# EAGLE design ble_keyboard (EAGLE 9.1.2)

## Sheet 1 of 2: Cover page

## Sheet 2 of 2
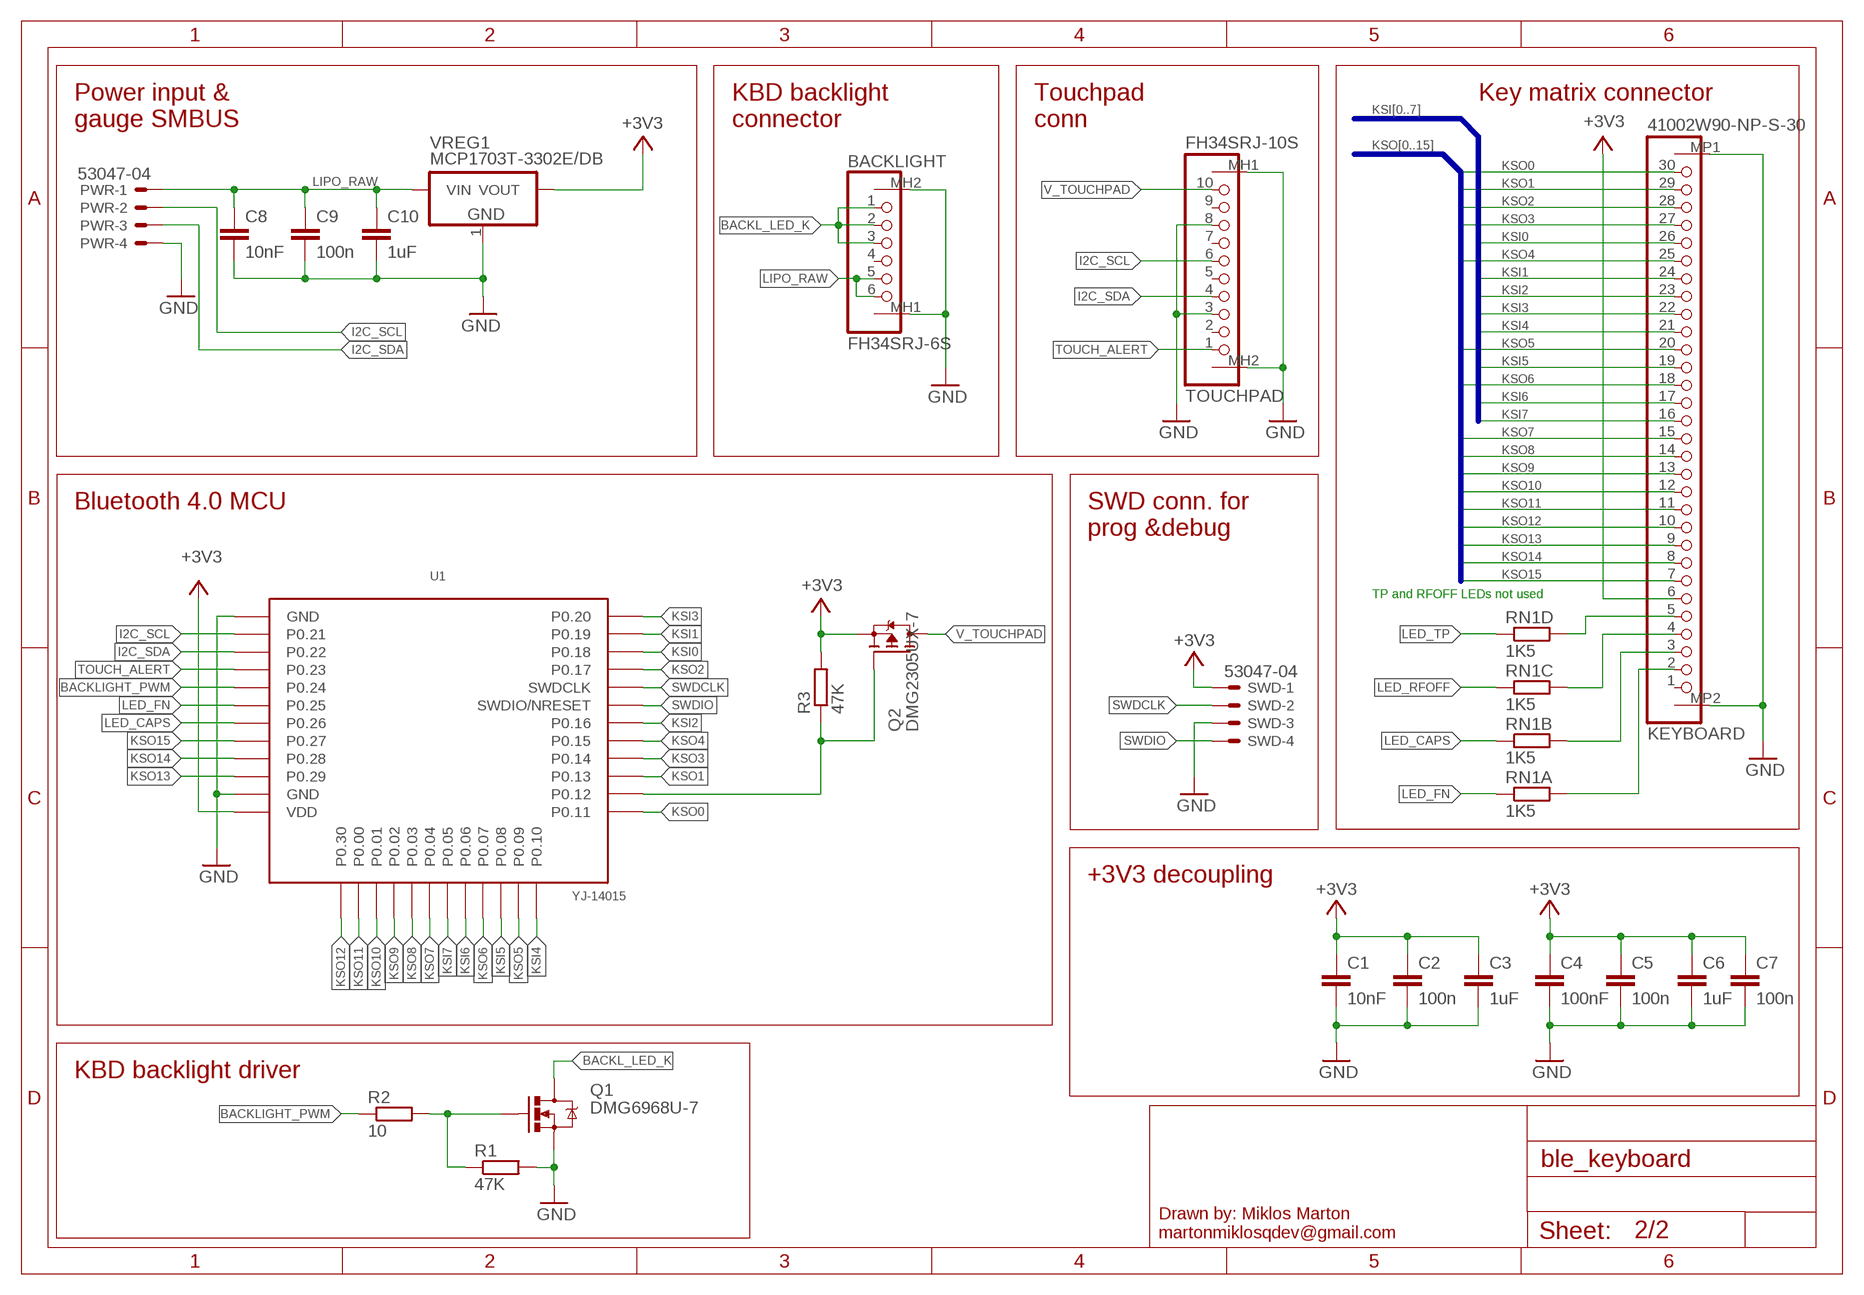
[diagram p0: schematic, sheet 2]

### Parts
BACKLIGHT  FH34SRJ-6S  [FH34SRJ-6S]
C1  10nF  C-EUC0603  [C0603]
C2  100n  C-EUC0603  [C0603]
C3  1uF  C-EUC0603  [C0603]
C4  100nF  C-EUC0603  [C0603]
C5  100n  C-EUC0603  [C0603]
C6  1uF  C-EUC0603  [C0603]
C7  100n  C-EUC0603  [C0603]
C8  10nF  C-EUC0603  [C0603]
C9  100n  C-EUC0603  [C0603]
C10  1uF  C-EUC0603  [C0603]
KEYBOARD  41002W90-NP-S-30  [41200W90-NP-S]
PWR  53047-04  [53047-04]
Q1  DMG6968U-7  MOSFET-NCHANNELSMD  [SOT23-3]
Q2  DMG2305UX-7  BSA223SPSOT23  [SOT23]
R1  47K  R-EU_R0603  [R0603]
R2  10  R-EU_R0603  [R0603]
R3  47K  R-EU_R0603  [R0603]
RN1  1K5  RESISTOR_ARRAY_4  [RN8P-4R-CRA06S]
SWD  53047-04  [53047-04]
TOUCHPAD  FH34SRJ-10S  [FH34SRJ-10S]
U1  YJ-14015  [YJ-14015]
VREG1  MCP1703T-3302E/DB  VREG_3PINS-SOT-223  [SOT-223]

### Nets
+3V3: C1.1 C2.1 C3.1 C4.1 C5.1 C6.1 C7.1 KEYBOARD.6 Q2.3(S) R3.2 SWD.1 U1.VDD VREG1.2(VOUT)
BACKL_LED_K: BACKLIGHT.1 BACKLIGHT.2 BACKLIGHT.3 Q1.3(D)
BACKLIGHT_PWM: R2.1 U1.P.24(P0.24)
GND: BACKLIGHT.MH1 BACKLIGHT.MH2 C1.2 C2.2 C3.2 C4.2 C5.2 C6.2 C7.2 C8.2 C9.2 C10.2 KEYBOARD.MP1 KEYBOARD.MP2 PWR.4 Q1.2(S) R1.2 SWD.3 TOUCHPAD.3 TOUCHPAD.8 TOUCHPAD.MH1 TOUCHPAD.MH2 U1.GND U1.GND@2(GND) VREG1.1(GND)
I2C_SCL: PWR.2 TOUCHPAD.6 U1.P.21(P0.21)
I2C_SDA: PWR.3 TOUCHPAD.4 U1.P.22(P0.22)
KSI0 [kb_signals]: KEYBOARD.26 U1.P.18(P0.18)
KSI1 [kb_signals]: KEYBOARD.24 U1.P.19(P0.19)
KSI2 [kb_signals]: KEYBOARD.23 U1.P.16(P0.16)
KSI3 [kb_signals]: KEYBOARD.22 U1.P.20(P0.20)
KSI4 [kb_signals]: KEYBOARD.21 U1.P.10(P0.10)
KSI5 [kb_signals]: KEYBOARD.19 U1.P.08(P0.08)
KSI6 [kb_signals]: KEYBOARD.17 U1.P.06(P0.06)
KSI7 [kb_signals]: KEYBOARD.16 U1.P.05(P0.05)
KSO0 [kb_signals]: KEYBOARD.30 U1.P.11(P0.11)
KSO1 [kb_signals]: KEYBOARD.29 U1.P.13(P0.13)
KSO2 [kb_signals]: KEYBOARD.28 U1.P.17(P0.17)
KSO3 [kb_signals]: KEYBOARD.27 U1.P.14(P0.14)
KSO4 [kb_signals]: KEYBOARD.25 U1.P.15(P0.15)
KSO5 [kb_signals]: KEYBOARD.20 U1.P.09(P0.09)
KSO6 [kb_signals]: KEYBOARD.18 U1.P.07(P0.07)
KSO7 [kb_signals]: KEYBOARD.15 U1.P.04(P0.04)
KSO8 [kb_signals]: KEYBOARD.14 U1.P.03(P0.03)
KSO9 [kb_signals]: KEYBOARD.13 U1.P.02(P0.02)
KSO10 [kb_signals]: KEYBOARD.12 U1.P.01(P0.01)
KSO11 [kb_signals]: KEYBOARD.11 U1.P.00(P0.00)
KSO12 [kb_signals]: KEYBOARD.10 U1.P.30(P0.30)
KSO13 [kb_signals]: KEYBOARD.9 U1.P.29(P0.29)
KSO14 [kb_signals]: KEYBOARD.8 U1.P.28(P0.28)
KSO15 [kb_signals]: KEYBOARD.7 U1.P.27(P0.27)
LED_CAPS: RN1.2 U1.P.26(P0.26)
LED_CAPS_R: KEYBOARD.3 RN1.7
LED_FN: RN1.1 U1.P.25(P0.25)
LED_FN_R: KEYBOARD.2 RN1.8
LED_RFOFF: RN1.3
LED_RFOFF_R: KEYBOARD.4 RN1.6
LED_TP: RN1.4
LED_TP_R: KEYBOARD.5 RN1.5
LIPO_RAW: BACKLIGHT.5 BACKLIGHT.6 C8.1 C9.1 C10.1 PWR.1 VREG1.3(VIN)
MOTOR_A_GATE_R: Q1.1(G) R1.1 R2.2
NENABLE_TOUCHPAD: Q2.1(G) R3.1 U1.P.12(P0.12)
SWDCLK: SWD.2 U1.SWDCLK
SWDIO: SWD.4 U1.SWDIO(SWDIO/NRESET)
TOUCH_ALERT: TOUCHPAD.1 U1.P.23(P0.23)
V_TOUCHPAD: Q2.2(D) TOUCHPAD.10
Unconnected: BACKLIGHT.4 KEYBOARD.1 TOUCHPAD.2 TOUCHPAD.5 TOUCHPAD.7 TOUCHPAD.9

### Buses
KSI[0..7]
KSO[0..15]

### Notes on the sheet
- Power input &
  gauge SMBUS
- KBD backlight
  connector
- Touchpad
  conn
- Key matrix connector
- Bluetooth 4.0 MCU
- SWD conn. for 
  prog &debug
- TP and RFOFF LEDs not used
- +3V3 decoupling
- KBD backlight driver

## Library data of the parts
BACKLIGHT = hirose_FH34SRJ:FH34SRJ-6S: 0.5mm Pitch, 1.0mm above the board Top and Top/Bottom Contact, Back-Flip Actuator Flexible Printed Circuit & Flexible Flat Cable ZIF Connectors
C1-C10 = rcl:C-EU: CAPACITOR, European symbol
KEYBOARD = JTC41002:41002W90-NP-S-30: http://www.jctc.com.cn/info_175.aspx?itemid=190
PWR SWD = con-molex:53?-04: CONNECTOR wire to board 1.25 mm (.049 inch) pitch header; MF: WALDOM/MOLEX; MPN: 53047-0410; OC_FARNELL: 9733060; OC_NEWARK: 38C9900
Q1 = SparkFun:MOSFET-NCHANNEL
Q2 = transistor-fet:BSA223SP: OptiMOS(R)-P Small-Signal-Transistor P-Channel, Enhancement mode, Super Logic Level (2.5 V rated) Source: http://www.infineon.com/upload/Document/BSA223SP_Rev1.3.pdf; OC_TME: DMG2305UX-7
R1-R3 = rcl:R-EU_: RESISTOR, European symbol
RN1 = dp_devices:RESISTOR_ARRAY_4: 4 Resistor Array 0603; OC_TME: DR1206-1K5-4/8
TOUCHPAD = hirose_FH34SRJ:FH34SRJ-10S: 0.5mm Pitch, 1.0mm above the board Top and Top/Bottom Contact, Back-Flip Actuator Flexible Printed Circuit & Flexible Flat Cable ZIF Connectors
U1 = YJ-14015:YJ-14015
VREG1 = dp_devices:VREG_3PINS: Various 3 pin voltage regulators in different packages Double check the right pinout for the right part; OC_TME: MCP1703T-3302E/DB

## Net classes
1 kb_signals: width 0.254 mm, drill 0.5 mm, clearance 0.152 mm

## Board
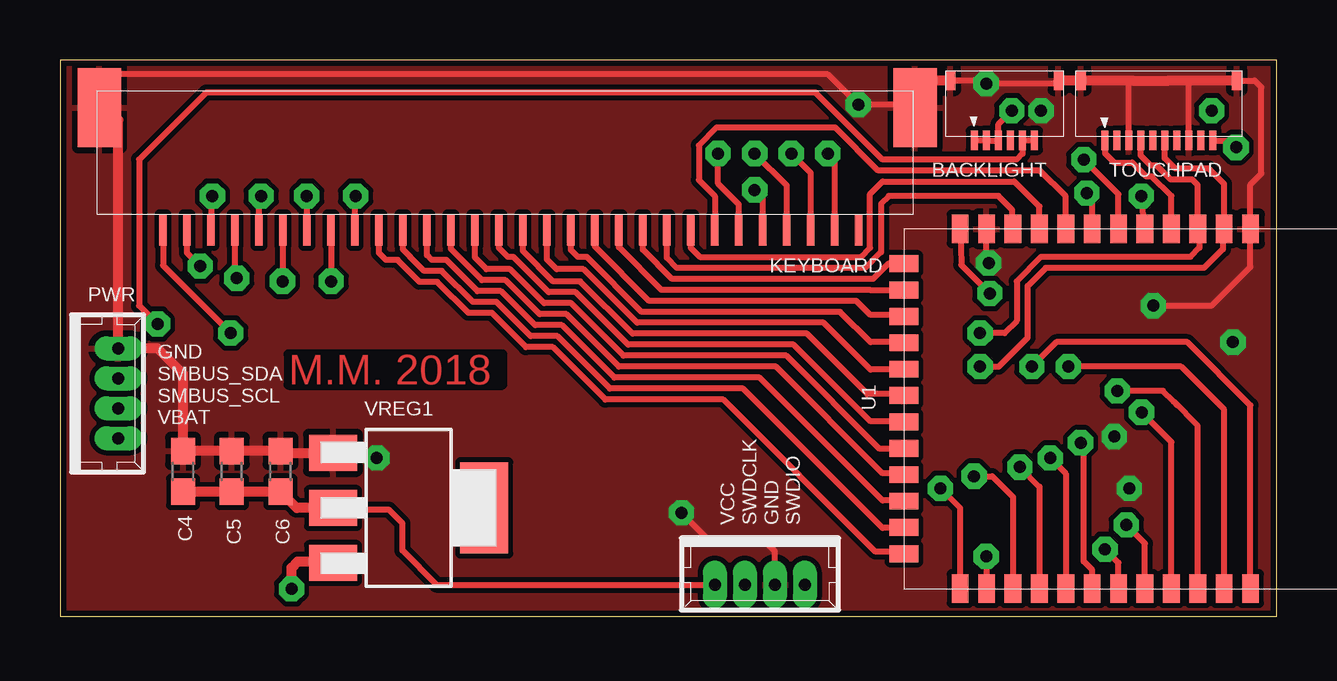
[diagram p1: board, top side]
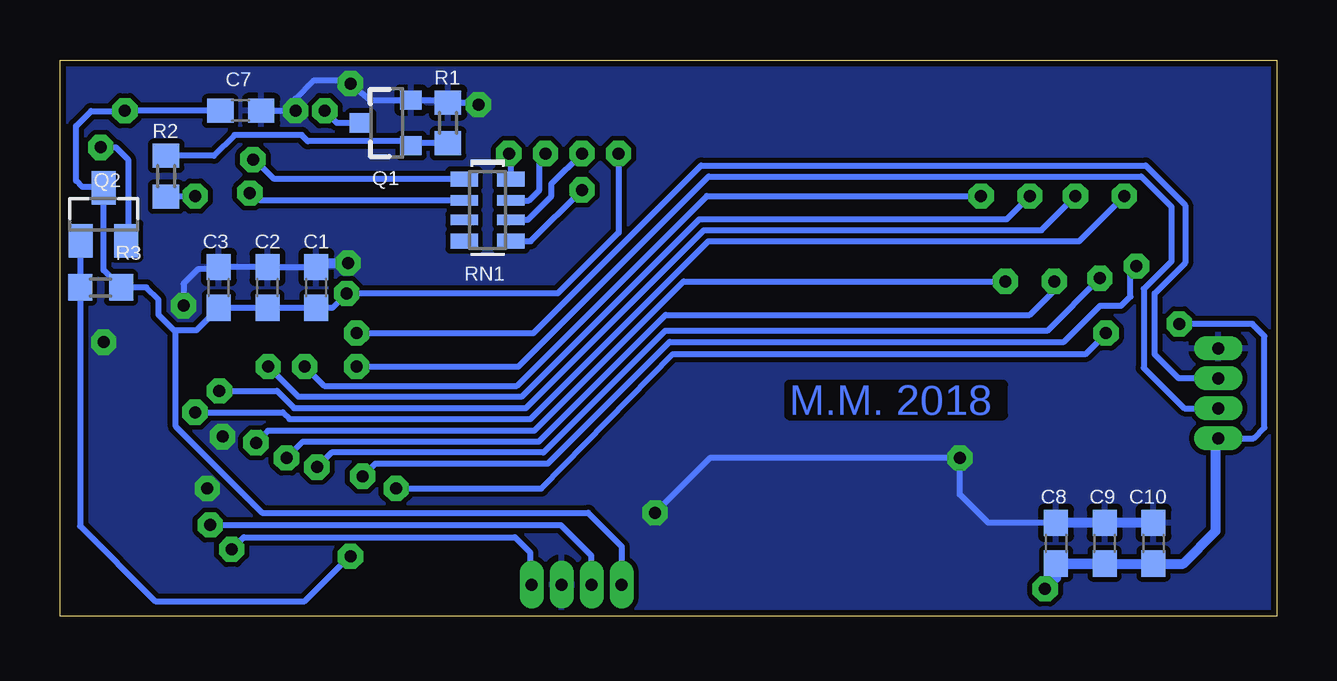
[diagram p2: board, bottom side, seen from below]

Size 50.71 x 23.2 mm. Coordinates in mm from the lower left corner, seen from the top.
Outline: 0,0 50.71,0 50.71,23.2 0,23.2 0,0
Copper layers (1*16): Top 0.035mm / dielectric 1.5mm / Bottom 0.035mm
Design rules "dirt_cheap_dirty_boards.v1 *": minimum track width 5mil, minimum drill 0.3mm, track to track 8mil, track to pad 6mil, pad to pad 6mil, via to via 6mil, smd to smd 0mil, copper to edge 10mil, drill to drill 10mil, minimum pad ring 10mil, minimum via ring 6mil, stop-mask expansion 2mil, vias tented up to drill 25mil, thermal gap 10mil

### Footprints (pad centres in the part's own frame; a part is rotated, then mirrored left to right if it is on the bottom)
FH34SRJ-6S = smd 0.3 x 0.8: 1 3.3,2.9; 2 2.8,2.9; 3 2.3,2.9; 4 1.8,2.9; 5 1.3,2.9; 6 0.8,2.9 | smd 0.4 x 0.8: MH1 -0.2,0.4; MH2 4.3,0.4
C0603 = smd 1.1 x 1: 1 -0.85,0; 2 0.85,0
41200W90-NP-S = smd 0.3 x 1.3: 1 1.25,6.75; 2 2.25,6.75; 3 3.25,6.75; 4 4.25,6.75; 5 5.25,6.75; 6 6.25,6.75; 7 7.25,6.75; 8 8.25,6.75; 9 9.25,6.75; 10 10.25,6.75; 11 11.25,6.75; 12 12.25,6.75; 13 13.25,6.75; 14 14.25,6.75; 15 15.25,6.75; 16 16.25,6.75; 17 17.25,6.75; 18 18.25,6.75; 19 19.25,6.75; 20 20.25,6.75; 21 21.25,6.75; 22 22.25,6.75; 23 23.25,6.75; 24 24.25,6.75; 25 25.25,6.75; 26 26.25,6.75; 27 27.25,6.75; 28 28.25,6.75; 29 29.25,6.75; 30 30.25,6.75 | smd 1.8 x 3.3: MP1 -1.1,1.65; MP2 32.9,1.65
53047-04 = drill 0.5 pad 0.698 long: 1 1.875,0.45; 2 0.625,0.45; 3 -0.625,0.45; 4 -1.875,0.45
SOT23-3 = smd 0.8 x 0.9: 1 -0.95,-1; 2 0.95,-1; 3 0,1.1
SOT23 = smd 1 x 1.4: 1 -0.95,-1.1; 2 0.95,-1.1; 3 0,1.1
R0603 = smd 1 x 1.1: 1 -0.85,0; 2 0.85,0
RN8P-4R-CRA06S = smd 0.63 x 1.15: 1 -1.295,-0.975; 4 1.295,-0.975; 5 1.295,0.975; 8 -1.295,0.975 | smd 0.44 x 1.15: 2 -0.4,-0.975; 3 0.4,-0.975; 6 0.4,0.975; 7 -0.4,0.975
FH34SRJ-10S = smd 0.3 x 0.8: 1 5.3,2.9; 2 4.8,2.9; 3 4.3,2.9; 4 3.8,2.9; 5 3.3,2.9; 6 2.8,2.9; 7 2.3,2.9; 8 1.8,2.9; 9 1.3,2.9; 10 0.8,2.9 | smd 0.4 x 0.8: MH1 -0.2,0.4; MH2 6.3,0.4
YJ-14015 = smd 1.2 x 0.7: GND -7.5,3.45; GND@2 -7.5,14.45; P.11 7.5,2.35; P.12 7.5,3.45; P.13 7.5,4.55; P.14 7.5,5.65; P.15 7.5,6.75; P.16 7.5,7.85; P.17 7.5,11.15; P.18 7.5,12.25; P.19 7.5,13.35; P.20 7.5,14.45; P.21 -7.5,13.35; P.22 -7.5,12.25; P.23 -7.5,11.15; P.24 -7.5,10.05; P.25 -7.5,8.95; P.26 -7.5,7.85; P.27 -7.5,6.75; P.28 -7.5,5.65; P.29 -7.5,4.55; SWDCLK 7.5,10.05; SWDIO 7.5,8.95; VDD -7.5,2.35 | smd 0.7 x 1.2: P.00 -4.95,0; P.01 -3.85,0; P.02 -2.75,0; P.03 -1.65,0; P.04 -0.55,0; P.05 0.55,0; P.06 1.65,0; P.07 2.75,0; P.08 3.85,0; P.09 4.95,0; P.10 6.05,0; P.30 -6.05,0
SOT-223 = smd 1.5 x 2: 1 -2.3,-3.15; 2 0,-3.15; 3 2.3,-3.15 | smd 3.8 x 2: 4 0,3.15

### Placement (x,y rotation side)
BACKLIGHT  41.42,22.74 180 top
C1  40.03,13.72 90 bottom
C2  42.06,13.72 90 bottom
C3  44.09,13.72 90 bottom
C4  5.13,6.05 90 top
C5  7.16,6.05 90 top
C6  9.19,6.05 90 top
C7  43.18,21.08 0 bottom
C8  9.19,3.05 90 bottom
C9  7.16,3.05 90 bottom
C10  5.13,3.05 90 bottom
KEYBOARD  34.54,22.86 180 top
PWR  1.98,9.3 270 top
Q1  37.08,20.57 90 bottom
Q2  48.9,16.76 0 bottom
R1  34.54,20.57 90 bottom
R2  46.29,18.35 90 bottom
R3  49.02,13.72 0 bottom
RN1  32.89,16.94 270 bottom
SWD  29.18,1.77 180 top
TOUCHPAD  48.85,22.74 180 top
U1  35.17,8.66 270 top
VREG1  14.53,4.52 270 top

### Tracks (layer width: path | path; a pad name or v marks a point on that pad's centre or on a via)
+3V3  (via drill 0.5 pad 1.05)
  Top 0.254: 37.59,16.18 U1.VDD 37.57,14.65 v38.76,13.46 | SWD.1 15.7,1.32 14.28,2.74 14.28,3.89 13.72,4.45 11.46,4.45 VREG1.2 | 48.05,21.03 arc90 v48.01,21.08 | KEYBOARD.6 28.29,17.17 27.43,18.03 v27.43,19.3
  Top 0.406: VREG1.2 9.87,4.52 C6.1 C5.1 C4.1
  Bottom 0.254: v38.76,13.46 39.36,12.87 C1.1 C2.1 C3.1 45.02,11.94 45.97,11.94 | v38.76,13.46 38.73,13.46 | SWD.1 27.3,2.92 28.7,4.32 42.29,4.32 45.89,7.92 45.89,11.85 45.97,11.94 | v27.43,19.3 27.43,16 29.97,13.46 v38.76,13.46 | 45.97,11.94 46.61,12.57 46.61,13.21 47.12,13.72 R3.2 48.9,14.44 Q2.3 | 48.94,17.91 49.78,17.91 50.04,18.16 50.04,20.45 49.41,21.07 v48.02,21.07 v48.01,21.08 C7.1
  Bottom 0.406: Q2.3 48.94,17.91 | v48.01,21.08 v48.02,21.07
BACKL_LED_K  (via drill 0.5 pad 1.05)
  Top 0.254: BACKLIGHT.1 BACKLIGHT.2 BACKLIGHT.3 39.12,20.52 v39.67,21.08
  Bottom 0.254: Q1.3 39.17,20.57 v39.67,21.08
BACKLIGHT_PWM  (via drill 0.5 pad 1.05)
  Top 0.254: U1.P.24 v45.08,17.53
  Bottom 0.254: R2.1 46.09,17.53 v45.08,17.53
GND  (via drill 0.5 pad 1.05)
  Top 0.254: TOUCHPAD.8 47.05,22.34 46.23,22.34 | TOUCHPAD.3 44.55,22.34 44.7,22.34 | U1.GND 38.57,14.87 v38.71,14.73 | v45.57,12.95 48.01,12.95 49.62,14.57 U1.GND@2 49.62,18 50.08,18.46 50.08,22.06 49.79,22.34 TOUCHPAD.MH1 | VREG1.1 12.99,6.82 v13.21,6.6 | KEYBOARD.MP1 35.52,21.34 v33.27,21.34 32,22.61 1.78,22.61 1.78,21.34 KEYBOARD.MP2 1.76,21.09 2.03,21.09 | SWD.3 29.8,2.71 29.46,3.05 27.18,3.05 v25.91,4.32 | BACKLIGHT.MH2 38.48,22.34 v38.61,22.22 41.49,22.22 BACKLIGHT.MH1
  Top 0.406: TOUCHPAD.MH1 46.23,22.34 44.7,22.34 TOUCHPAD.MH2 BACKLIGHT.MH1 | BACKLIGHT.MH2 35.64,22.34 | C4.2 C5.2 C6.2 9.27,6.82 VREG1.1 11.12,6.66 | 4.91,7.12 C4.2 | 2.03,21.09 2.43,20.7 PWR.4 4.06,11.18 5.13,10.11 C4.2
  Bottom 0.254: v33.27,21.34 33.69,21.42 R1.2 34.64,21.52 Q1.2 37.79,21.52 v38.61,22.22 38.62,22.35 40.13,22.35 40.89,21.59 v40.89,21.08 C7.2 | 39.94,14.48 C1.2 C2.2 C3.2 44.18,14.48 44.96,14.48 45.57,13.87 v45.57,12.95 | v25.91,4.32 23.62,6.6 v13.21,6.6 13.21,5.08 12.03,3.9 C8.2
  Bottom 0.406: C10.2 C8.2 C9.2 | C1.2 39.86,14.73 v38.71,14.73
  other vias: 48.9,11.43 44.58,5.33 43.94,7.49
  pour Top: 0,23.11 50.78,23.11 50.78,0 0,0
  pour Bottom: 0,23.11 50.78,23.11 50.78,0 0,0
I2C_SCL  (via drill 0.5 pad 1.05)
  Top 0.254: TOUCHPAD.6 46.05,19.23 46.05,19.11 46.48,18.67 47.88,18.67 48.52,18.02 U1.P.21 48.47,16.04 48.47,15.31 47.69,14.53 41.08,14.53 40.34,13.78 40.34,11.62 39.13,10.41 v38.35,10.41
  Bottom 0.254: v38.35,10.41 31.6,10.41 23.68,18.34 5.65,18.34 4.39,17.08 4.39,14.8 5.54,13.65 5.54,10.36 3.85,8.67 PWR.2
I2C_SDA  (via drill 0.5 pad 1.05)
  Top 0.254: TOUCHPAD.4 45.05,19.22 45.47,18.8 45.71,18.8 46.29,18.21 47.19,18.21 47.42,17.98 U1.P.22 47.5,16.12 47.5,15.37 47.12,14.99 40.89,14.99 39.88,13.97 39.88,12.32 39.37,11.81 v38.35,11.81
  Bottom 0.254: PWR.3 4.08,9.92 5.08,10.92 5.08,13.46 3.81,14.73 3.81,17.14 5.46,18.8 23.99,18.8 30.98,11.81 v38.35,11.81
KSI0  (via drill 0.5 pad 1.05)
  Top 0.254: 46.42,8.95 46.57,8.8 | 46.42,8.95 45.97,9.4 v44.07,9.4 | KEYBOARD.26 8.29,17.44 v8.38,17.53 | U1.P.18 47.42,7.95 46.42,8.95
  Bottom 0.254: v44.07,9.4 41.67,9.4 40.96,8.69 31.3,8.69 23.88,16.1 9.8,16.1 v8.38,17.53
KSI1  (via drill 0.5 pad 1.05)
  Top 0.254: v42.04,10.41 46.74,10.41 48.52,8.63 U1.P.19 | KEYBOARD.24 10.29,17.52 v10.29,17.53
  Bottom 0.254: v10.29,17.53 11.25,16.56 24.07,16.56 31.48,9.15 40.77,9.15 v42.04,10.41
KSI2  (via drill 0.5 pad 1.05)
  Top 0.254: KEYBOARD.23 v11.29,13.98 v11.3,13.97 | U1.P.16 43.02,1.94 42.67,2.29 42.67,7.11 v42.55,7.24
  Bottom 0.254: v42.55,7.24 42.04,7.75 30.94,7.75 24.72,13.97 v11.3,13.97
KSI3  (via drill 0.5 pad 1.05)
  Top 0.254: v40.51,10.41 41.53,11.43 46.99,11.43 49.62,8.8 U1.P.20 | KEYBOARD.22 12.29,17.5 v12.32,17.53
  Bottom 0.254: v40.51,10.41 39.7,9.61 31.66,9.61 23.75,17.53 v12.32,17.53
KSI4
  Top 0.254: KEYBOARD.21 13.29,15.15 13.59,14.86 14.07,14.86 14.99,13.95 15.73,13.95 17.02,12.65 18,12.65 19.43,11.23 20.55,11.23 22.73,9.04 27.65,9.04 33.99,2.7 35.21,2.7 U1.P.10
KSI5
  Top 0.254: U1.P.08 35.28,4.83 34.29,4.83 29.16,9.96 23.11,9.96 20.93,12.14 19.8,12.14 18.38,13.56 17.4,13.56 16.11,14.86 15.49,14.86 15.29,15.06 KEYBOARD.19
KSI6
  Top 0.254: U1.P.06 35.28,6.99 34.16,6.99 30.28,10.87 23.49,10.87 21.3,13.06 20.18,13.06 18.76,14.48 17.78,14.48 17.29,14.96 KEYBOARD.17
KSI7
  Top 0.254: U1.P.05 35.28,8.13 33.78,8.13 30.58,11.33 23.68,11.33 21.49,13.51 20.37,13.51 18.9,14.99 18.67,14.99 18.29,15.36 KEYBOARD.16
KSO0  (via drill 0.5 pad 1.05)
  Top 0.254: KEYBOARD.30 4.29,14.63 v7.11,11.81 | U1.P.11 37.52,4.51 v36.7,5.33
  Bottom 0.254: v7.11,11.81 7.09,11.81 7.98,10.92 25.18,10.92 30.64,5.33 v36.7,5.33
KSO1  (via drill 0.5 pad 1.05)
  Top 0.254: v38.1,5.84 38.86,5.84 39.72,4.98 U1.P.13 | v5.84,14.61 5.29,15.15 KEYBOARD.29
  Bottom 0.254: v38.1,5.84 37.57,6.38 30.37,6.38 25.3,11.45 8.86,11.45 7.35,12.95 6.48,12.95 6.1,13.34 6.1,14.35 v5.84,14.61
KSO2  (via drill 0.5 pad 1.05)
  Top 0.254: v6.35,17.53 6.29,17.47 KEYBOARD.28 | U1.P.17 46.32,7.27 v45.09,8.51
  Bottom 0.254: v45.09,8.51 41.42,8.51 41.15,8.23 31.11,8.23 23.69,15.65 8.23,15.65 v6.35,17.53
KSO3  (via drill 0.5 pad 1.05)
  Top 0.254: v7.37,14.1 7.29,14.17 KEYBOARD.27 | U1.P.14 40.82,5.41 v40.01,6.22
  Bottom 0.254: v7.37,14.1 9.56,11.9 25.49,11.9 30.56,6.83 39.4,6.83 v40.01,6.22
KSO4  (via drill 0.5 pad 1.05)
  Top 0.254: 9.27,16.09 KEYBOARD.25 9.29,13.99 v9.27,13.97 | U1.P.15 41.92,5.96 v41.27,6.6
  Bottom 0.254: v41.27,6.6 40.59,7.29 30.75,7.29 25.47,12.57 10.29,12.57 9.27,13.59 v9.27,13.97
KSO5
  Top 0.254: U1.P.09 35.27,3.68 34.29,3.68 28.47,9.5 22.92,9.5 20.73,11.68 19.62,11.68 18.19,13.11 17.21,13.11 15.92,14.4 15.18,14.4 14.59,14.99 14.61,14.99 14.29,15.3 KEYBOARD.20
KSO6
  Top 0.254: U1.P.07 35.24,5.97 34.29,5.97 29.84,10.41 23.3,10.41 21.11,12.6 19.99,12.6 18.57,14.02 17.59,14.02 16.29,15.32 KEYBOARD.18
KSO7
  Top 0.254: U1.P.04 35.11,9.27 33.66,9.27 31.14,11.79 23.87,11.79 21.68,13.97 20.56,13.97 19.29,15.24 KEYBOARD.15
KSO8
  Top 0.254: U1.P.03 35.15,10.29 33.78,10.29 31.83,12.24 24.06,12.24 21.82,14.48 20.7,14.48 20.29,14.88 KEYBOARD.14
KSO9
  Top 0.254: U1.P.02 35.28,11.43 33.78,11.43 32.51,12.7 24.25,12.7 21.96,14.99 21.59,14.99 21.29,15.28 KEYBOARD.13
KSO10
  Top 0.254: U1.P.01 35.11,12.57 33.78,12.57 33.2,13.16 24.56,13.16 22.29,15.43 KEYBOARD.12
KSO11
  Top 0.254: U1.P.00 35.53,13.59 33.78,13.59 33.76,13.61 25.07,13.61 23.29,15.39 KEYBOARD.11
KSO12
  Top 0.254: U1.P.30 34.52,14.71 33.89,14.07 25.52,14.07 24.29,15.29 KEYBOARD.10
KSO13
  Top 0.254: U1.P.29 39.7,16.95 39.12,17.53 34.54,17.53 34.22,17.21 34.22,15.18 33.57,14.53 25.7,14.53 25.29,14.94 KEYBOARD.9
KSO14
  Top 0.254: U1.P.28 40.82,17.09 39.78,18.14 34.29,18.14 33.77,17.61 33.77,15.37 33.38,14.99 26.67,14.99 26.29,15.36 KEYBOARD.8
KSO15
  Top 0.254: KEYBOARD.7 27.29,17.52 26.63,18.19 26.63,19.64 27.37,20.38 32.32,20.38 34.1,18.59 40.84,18.59 41.92,17.51 U1.P.27
LED_CAPS  (via drill 0.5 pad 1.05)
  Top 0.254: 42.93,17.53 v42.8,17.65 | 42.93,17.53 42.95,17.5 | U1.P.26 43.02,17.43 42.93,17.53
  Bottom 0.254: RN1.2 42.36,17.34 42.67,17.66 v42.8,17.65
LED_CAPS_R  (via drill 0.5 pad 1.05)
  Top 0.254: KEYBOARD.3 31.29,18.49 v30.48,19.3
  Bottom 0.254: RN1.7 31.17,17.34 30.73,17.78 30.73,19.05 v30.48,19.3
LED_FN  (via drill 0.5 pad 1.05)
  Top 0.254: 43.56,18.16 43.57,18.15 | 43.56,18.16 v42.67,19.05 | U1.P.25 44.12,17.6 43.56,18.16
  Bottom 0.254: RN1.1 41.78,18.24 42.6,19.05 v42.67,19.05
LED_FN_R  (via drill 0.5 pad 1.05)
  Top 0.254: KEYBOARD.2 32.29,19.01 v32,19.3
  Bottom 0.254: RN1.8 31.92,19.14 v32,19.3
LED_RFOFF_R  (via drill 0.5 pad 1.05)
  Top 0.254: KEYBOARD.4 30.29,17.97 v28.96,19.3
  Bottom 0.254: RN1.6 31.21,16.54 30.23,17.53 30.23,18.03 v28.96,19.3
LED_TP_R  (via drill 0.5 pad 1.05)
  Top 0.254: KEYBOARD.5 29.29,17.44 v28.96,17.78
  Bottom 0.254: RN1.5 31.09,15.65 v28.96,17.78
LIPO_RAW  (via drill 0.5 pad 1.05)
  Top 0.254: BACKLIGHT.6 BACKLIGHT.5 40.12,19.29 39.88,19.05 34.29,19.05 31.5,21.84 6.1,21.84 3.3,19.05 3.3,12.95 v4.06,12.19
  Top 0.406: v9.65,1.14 9.65,2.03 9.91,2.29 11.31,2.29 VREG1.3
  Bottom 0.254: PWR.1 0.96,7.42 0.51,7.87 0.51,11.68 1.02,12.19 v4.06,12.19
  Bottom 0.406: C8.1 C10.1 3.9,2.2 2.54,3.56 2.54,7.31 PWR.1 | C9.1 C8.1 | C8.1 9.22,2.22 | C8.1 9.2,1.6 v9.65,1.14
MOTOR_A_GATE_R
  Bottom 0.254: R1.1 35.98,19.72 Q1.1 36.27,19.81 40.39,19.81 40.64,20.07 43.43,20.07 44.3,19.2 R2.2 46.12,19.24
NENABLE_TOUCHPAD  (via drill 0.5 pad 1.05)
  Top 0.254: v38.61,2.5 38.61,1.17 U1.P.12
  Bottom 0.254: Q2.1 49.87,15.65 R3.1 49.87,3.77 46.74,0.64 40.51,0.64 38.61,2.54 v38.61,2.5
SWDCLK  (via drill 0.5 pad 1.05)
  Top 0.254: U1.SWDCLK 45.22,3.04 v44.45,3.81
  Bottom 0.254: SWD.2 28.57,1.35 28.57,2.54 28.64,2.6 28.83,2.79 29.84,3.81 v44.45,3.81
SWDIO  (via drill 0.5 pad 1.05)
  Top 0.254: U1.SWDIO 44.12,2.23 v43.56,2.79
  Bottom 0.254: v43.56,2.79 43.05,3.3 31.75,3.3 31.11,2.67 31.11,1.39 SWD.4
TOUCH_ALERT
  Top 0.254: U1.P.23 46.32,17.54 45.52,18.34 45.28,18.34 45.27,18.34 44.69,18.92 43.94,18.92 43.55,19.31 TOUCHPAD.1
V_TOUCHPAD  (via drill 0.5 pad 1.05)
  Top 0.254: TOUCHPAD.10 48.74,19.84 v49.02,19.56
  Bottom 0.254: v49.02,19.56 48.39,19.56 47.88,19.05 47.88,15.73
  Bottom 0.406: 47.88,15.73 Q2.2

### Text on the board
Top: M.M. 2018
Bottom: M.M. 2018
tPlace: GND / SMBUS_SDA / SMBUS_SCL / VBAT | VCC / SWDCLK / GND / SWDIO
_tNames: CN1 | CN2 | CON2 | U1 | CON3 | VREG1 | C4 | C5 | C6
_bNames: R1 | C7 | R2 | Q1 | C1 | C2 | C3 | RN1 | C10 | C9 | C8